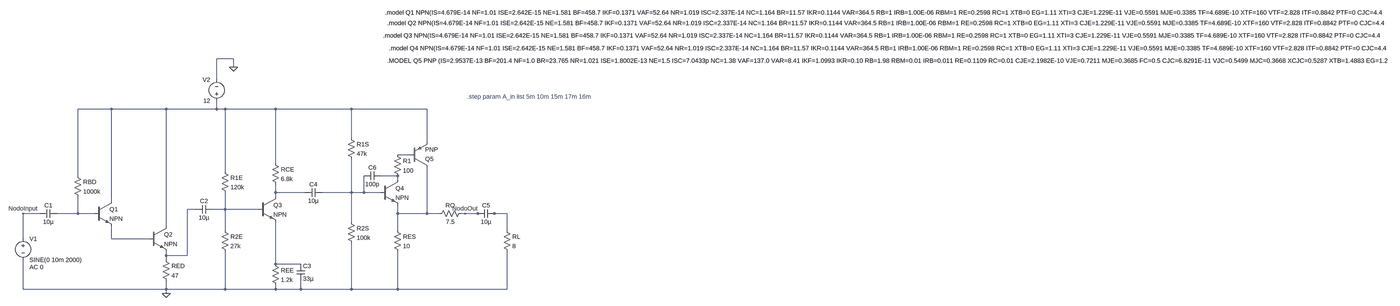
[diagram p0: schematic AmpFinalEstadiscamentecorrecto.asc, whole sheet]
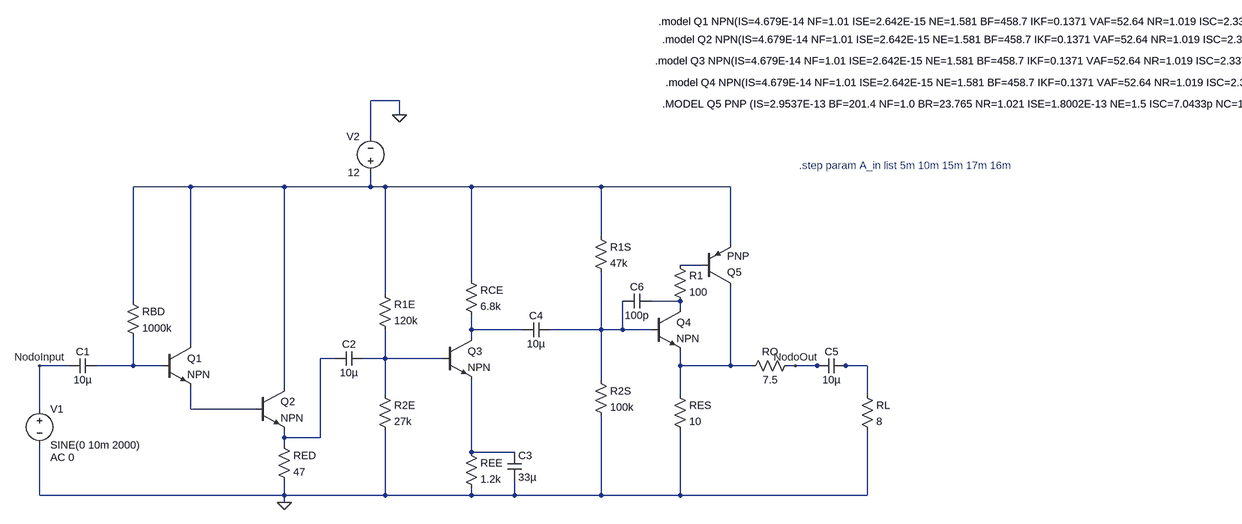
[diagram p1: schematic AmpFinalEstadiscamentecorrecto.asc, part, row 1 of 1, column 1 of 2]
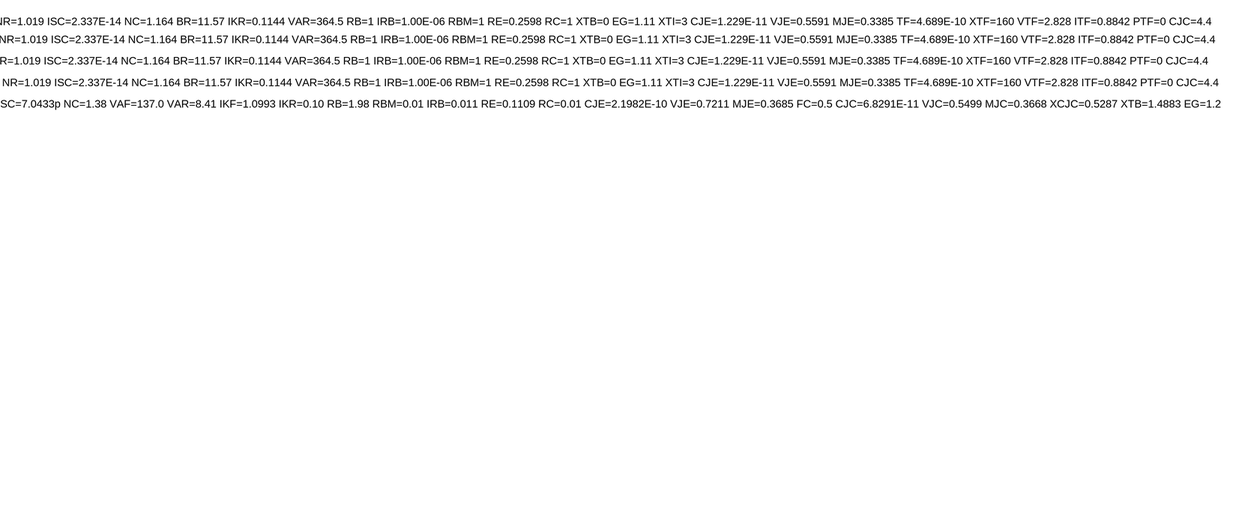
[diagram p2: schematic AmpFinalEstadiscamentecorrecto.asc, part, row 1 of 1, column 2 of 2]
AmpFinalEstadiscamentecorrecto.asc, the LTspice schematic file:
Version 4.1
SHEET 1 6804 680
WIRE 512 -544 448 -544
WIRE 512 -512 512 -544
WIRE 448 -464 448 -544
WIRE 48 -352 -80 -352
WIRE 256 -352 48 -352
WIRE 448 -352 448 -384
WIRE 448 -352 256 -352
WIRE 480 -352 448 -352
WIRE 672 -352 480 -352
WIRE 960 -352 672 -352
WIRE 1248 -352 960 -352
WIRE 960 -224 960 -352
WIRE 1248 -208 1248 -352
WIRE 1184 -160 1136 -160
WIRE 672 -128 672 -352
WIRE 480 -96 480 -352
WIRE -80 -80 -80 -352
WIRE 1136 -80 1072 -80
WIRE 1136 -64 1136 -80
WIRE 672 -16 672 -48
WIRE 784 -16 672 -16
WIRE 960 -16 960 -144
WIRE 960 -16 848 -16
WIRE 1008 -16 1008 -80
WIRE 1008 -16 960 -16
WIRE 1072 -16 1008 -16
WIRE 672 0 672 -16
WIRE 48 16 48 -352
WIRE 368 48 336 48
WIRE 480 48 480 -16
WIRE 480 48 432 48
WIRE 608 48 480 48
WIRE -224 64 -288 64
WIRE -80 64 -80 0
WIRE -80 64 -160 64
WIRE -16 64 -80 64
WIRE 1136 64 1136 32
WIRE 1248 64 1248 -112
WIRE 1248 64 1136 64
WIRE 1296 64 1248 64
WIRE 1392 64 1376 64
WIRE 1440 64 1392 64
WIRE 1456 64 1440 64
WIRE 1504 64 1488 64
WIRE 1552 64 1504 64
WIRE 960 96 960 -16
WIRE 256 112 256 -352
WIRE 480 128 480 48
WIRE 1136 128 1136 64
WIRE 1552 128 1552 64
WIRE -288 160 -288 64
WIRE 48 160 48 112
WIRE 192 160 48 160
WIRE 256 224 256 208
WIRE 336 224 336 48
WIRE 336 224 256 224
WIRE 256 240 256 224
WIRE 672 256 672 96
WIRE 768 256 672 256
WIRE -288 352 -288 240
WIRE 256 352 256 320
WIRE 256 352 -288 352
WIRE 480 352 480 208
WIRE 480 352 256 352
WIRE 672 352 672 336
WIRE 672 352 480 352
WIRE 768 352 768 320
WIRE 768 352 672 352
WIRE 960 352 960 176
WIRE 960 352 768 352
WIRE 1136 352 1136 208
WIRE 1136 352 960 352
WIRE 1552 352 1552 208
WIRE 1552 352 1136 352
WIRE 256 368 256 352
FLAG 256 368 0
FLAG 512 -512 0
FLAG -288 64 NodoInput
FLAG 1392 64 NodoOut
SYMBOL npn -16 16 R0
SYMATTR InstName Q1
SYMBOL res -96 -96 R0
SYMATTR InstName RBD
SYMATTR Value 1000k
SYMBOL cap -160 48 R90
WINDOW 0 0 32 VBottom 2
WINDOW 3 32 32 VTop 2
SYMATTR InstName C1
SYMATTR Value 10µ
SYMBOL npn 192 112 R0
SYMATTR InstName Q2
SYMBOL res 240 224 R0
SYMATTR InstName RED
SYMATTR Value 47
SYMBOL cap 432 32 R90
WINDOW 0 0 32 VBottom 2
WINDOW 3 32 32 VTop 2
SYMATTR InstName C2
SYMATTR Value 10µ
SYMBOL res 464 -112 R0
SYMATTR InstName R1E
SYMATTR Value 120k
SYMBOL res 464 112 R0
SYMATTR InstName R2E
SYMATTR Value 27k
SYMBOL npn 608 0 R0
SYMATTR InstName Q3
SYMBOL res 656 -144 R0
SYMATTR InstName RCE
SYMATTR Value 6.8k
SYMBOL res 656 240 R0
SYMATTR InstName REE
SYMATTR Value 1.2k
SYMBOL cap 752 256 R0
SYMATTR InstName C3
SYMATTR Value 33µ
SYMBOL voltage 448 -368 R180
WINDOW 0 24 96 Left 2
WINDOW 3 24 16 Left 2
SYMATTR InstName V2
SYMATTR Value 12
SYMBOL cap 848 -32 R90
WINDOW 0 0 32 VBottom 2
WINDOW 3 32 32 VTop 2
SYMATTR InstName C4
SYMATTR Value 10µ
SYMBOL res 944 80 R0
SYMATTR InstName R2S
SYMATTR Value 100k
SYMBOL res 944 -240 R0
SYMATTR InstName R1S
SYMATTR Value 47k
SYMBOL npn 1072 -64 R0
SYMATTR InstName Q4
SYMBOL res 1120 112 R0
SYMATTR InstName RES
SYMATTR Value 10
SYMBOL pnp 1184 -112 M180
SYMATTR InstName Q5
SYMBOL voltage -288 144 R0
WINDOW 123 24 124 Left 2
WINDOW 39 0 0 Left 0
SYMATTR Value2 AC 0
SYMATTR InstName V1
SYMATTR Value SINE(0 10m 2000)
SYMBOL res 1536 112 R0
SYMATTR InstName RL
SYMATTR Value 8
SYMBOL res 1392 48 R90
WINDOW 0 0 56 VBottom 2
WINDOW 3 32 56 VTop 2
SYMATTR InstName RO
SYMATTR Value 7.5
SYMBOL cap 1504 48 R90
WINDOW 0 0 32 VBottom 2
WINDOW 3 32 32 VTop 2
SYMATTR InstName C5
SYMATTR Value 10µ
SYMBOL cap 1008 -64 R270
WINDOW 0 32 32 VTop 2
WINDOW 3 0 32 VBottom 2
SYMATTR InstName C6
SYMATTR Value 100p
SYMBOL res 1120 -176 R0
SYMATTR InstName R1
SYMATTR Value 100
TEXT 1088 -720 Left 2 !.model Q1 NPN(IS=4.679E-14 NF=1.01 ISE=2.642E-15 NE=1.581 BF=458.7 IKF=0.1371 VAF=52.64 NR=1.019 ISC=2.337E-14 NC=1.164 BR=11.57 IKR=0.1144 VAR=364.5 RB=1 IRB=1.00E-06 RBM=1 RE=0.2598 RC=1 XTB=0 EG=1.11 XTI=3 CJE=1.229E-11 VJE=0.5591 MJE=0.3385 TF=4.689E-10 XTF=160 VTF=2.828 ITF=0.8842 PTF=0 CJC=4.42E-12 VJC=0.1994 MJC=0.2782 XCJC=0.6193 TR=1.00E-32 CJS=0 VJS=0.75 MJS=0.333 FC=0.7936 Vceo=45 Icrating=100m mfg=Philips)
TEXT 1096 -680 Left 2 !.model Q2 NPN(IS=4.679E-14 NF=1.01 ISE=2.642E-15 NE=1.581 BF=458.7 IKF=0.1371 VAF=52.64 NR=1.019 ISC=2.337E-14 NC=1.164 BR=11.57 IKR=0.1144 VAR=364.5 RB=1 IRB=1.00E-06 RBM=1 RE=0.2598 RC=1 XTB=0 EG=1.11 XTI=3 CJE=1.229E-11 VJE=0.5591 MJE=0.3385 TF=4.689E-10 XTF=160 VTF=2.828 ITF=0.8842 PTF=0 CJC=4.42E-12 VJC=0.1994 MJC=0.2782 XCJC=0.6193 TR=1.00E-32 CJS=0 VJS=0.75 MJS=0.333 FC=0.7936 Vceo=45 Icrating=100m mfg=Philips)
TEXT 1080 -632 Left 2 !.model Q3 NPN(IS=4.679E-14 NF=1.01 ISE=2.642E-15 NE=1.581 BF=458.7 IKF=0.1371 VAF=52.64 NR=1.019 ISC=2.337E-14 NC=1.164 BR=11.57 IKR=0.1144 VAR=364.5 RB=1 IRB=1.00E-06 RBM=1 RE=0.2598 RC=1 XTB=0 EG=1.11 XTI=3 CJE=1.229E-11 VJE=0.5591 MJE=0.3385 TF=4.689E-10 XTF=160 VTF=2.828 ITF=0.8842 PTF=0 CJC=4.42E-12 VJC=0.1994 MJC=0.2782 XCJC=0.6193 TR=1.00E-32 CJS=0 VJS=0.75 MJS=0.333 FC=0.7936 Vceo=45 Icrating=100m mfg=Philips)
TEXT 1104 -584 Left 2 !.model Q4 NPN(IS=4.679E-14 NF=1.01 ISE=2.642E-15 NE=1.581 BF=458.7 IKF=0.1371 VAF=52.64 NR=1.019 ISC=2.337E-14 NC=1.164 BR=11.57 IKR=0.1144 VAR=364.5 RB=1 IRB=1.00E-06 RBM=1 RE=0.2598 RC=1 XTB=0 EG=1.11 XTI=3 CJE=1.229E-11 VJE=0.5591 MJE=0.3385 TF=4.689E-10 XTF=160 VTF=2.828 ITF=0.8842 PTF=0 CJC=4.42E-12 VJC=0.1994 MJC=0.2782 XCJC=0.6193 TR=1.00E-32 CJS=0 VJS=0.75 MJS=0.333 FC=0.7936 Vceo=45 Icrating=100m mfg=Philips)
TEXT 1096 -536 Left 2 !.MODEL Q5 PNP (IS=2.9537E-13 BF=201.4 NF=1.0 BR=23.765 NR=1.021 ISE=1.8002E-13 NE=1.5 ISC=7.0433p NC=1.38 VAF=137.0 VAR=8.41 IKF=1.0993 IKR=0.10 RB=1.98 RBM=0.01 IRB=0.011 RE=0.1109 RC=0.01 CJE=2.1982E-10 VJE=0.7211 MJE=0.3685 FC=0.5 CJC=6.8291E-11 VJC=0.5499 MJC=0.3668 XCJC=0.5287 XTB=1.4883 EG=1.2343 XTI=3.0 Vceo=80 Icrating=3 mfg=fairchild)
TEXT 1400 -400 Left 2 ;.step param A_in list 5m 10m 15m 17m 16m

The netlist it stands for:
* AmpFinalEstadiscamentecorrecto.asc
Q1 N001 N008 N011 0 NPN
RBD N001 N008 1000k
C1 N008 NodoInput 10µ
Q2 N001 N011 N006 0 NPN
RED N006 0 47
C2 N007 N006 10µ
R1E N001 N007 120k
R2E N007 0 27k
Q3 N004 N007 N012 0 NPN
RCE N001 N004 6.8k
REE N012 0 1.2k
C3 N012 0 33µ
V2 N001 0 12
C4 N005 N004 10µ
R2S N005 0 100k
R1S N001 N005 47k
Q4 N003 N005 N009 0 NPN
RES N009 0 10
Q5 N009 N002 N001 0 PNP
V1 NodoInput 0 SINE(0 10m 2000) AC 0
RL N010 0 8
RO NodoOut N009 7.5
C5 N010 NodoOut 10µ
C6 N005 N003 100p
R1 N002 N003 100
.model NPN NPN
.model PNP PNP
.lib standard.bjt
.model Q1 NPN(IS=4.679E-14 NF=1.01 ISE=2.642E-15 NE=1.581 BF=458.7 IKF=0.1371 VAF=52.64 NR=1.019 ISC=2.337E-14 NC=1.164 BR=11.57 IKR=0.1144 VAR=364.5 RB=1 IRB=1.00E-06 RBM=1 RE=0.2598 RC=1 XTB=0 EG=1.11 XTI=3 CJE=1.229E-11 VJE=0.5591 MJE=0.3385 TF=4.689E-10 XTF=160 VTF=2.828 ITF=0.8842 PTF=0 CJC=4.42E-12 VJC=0.1994 MJC=0.2782 XCJC=0.6193 TR=1.00E-32 CJS=0 VJS=0.75 MJS=0.333 FC=0.7936 Vceo=45 Icrating=100m mfg=Philips)
.model Q2 NPN(IS=4.679E-14 NF=1.01 ISE=2.642E-15 NE=1.581 BF=458.7 IKF=0.1371 VAF=52.64 NR=1.019 ISC=2.337E-14 NC=1.164 BR=11.57 IKR=0.1144 VAR=364.5 RB=1 IRB=1.00E-06 RBM=1 RE=0.2598 RC=1 XTB=0 EG=1.11 XTI=3 CJE=1.229E-11 VJE=0.5591 MJE=0.3385 TF=4.689E-10 XTF=160 VTF=2.828 ITF=0.8842 PTF=0 CJC=4.42E-12 VJC=0.1994 MJC=0.2782 XCJC=0.6193 TR=1.00E-32 CJS=0 VJS=0.75 MJS=0.333 FC=0.7936 Vceo=45 Icrating=100m mfg=Philips)
.model Q3 NPN(IS=4.679E-14 NF=1.01 ISE=2.642E-15 NE=1.581 BF=458.7 IKF=0.1371 VAF=52.64 NR=1.019 ISC=2.337E-14 NC=1.164 BR=11.57 IKR=0.1144 VAR=364.5 RB=1 IRB=1.00E-06 RBM=1 RE=0.2598 RC=1 XTB=0 EG=1.11 XTI=3 CJE=1.229E-11 VJE=0.5591 MJE=0.3385 TF=4.689E-10 XTF=160 VTF=2.828 ITF=0.8842 PTF=0 CJC=4.42E-12 VJC=0.1994 MJC=0.2782 XCJC=0.6193 TR=1.00E-32 CJS=0 VJS=0.75 MJS=0.333 FC=0.7936 Vceo=45 Icrating=100m mfg=Philips)
.model Q4 NPN(IS=4.679E-14 NF=1.01 ISE=2.642E-15 NE=1.581 BF=458.7 IKF=0.1371 VAF=52.64 NR=1.019 ISC=2.337E-14 NC=1.164 BR=11.57 IKR=0.1144 VAR=364.5 RB=1 IRB=1.00E-06 RBM=1 RE=0.2598 RC=1 XTB=0 EG=1.11 XTI=3 CJE=1.229E-11 VJE=0.5591 MJE=0.3385 TF=4.689E-10 XTF=160 VTF=2.828 ITF=0.8842 PTF=0 CJC=4.42E-12 VJC=0.1994 MJC=0.2782 XCJC=0.6193 TR=1.00E-32 CJS=0 VJS=0.75 MJS=0.333 FC=0.7936 Vceo=45 Icrating=100m mfg=Philips)
.MODEL Q5 PNP (IS=2.9537E-13 BF=201.4 NF=1.0 BR=23.765 NR=1.021 ISE=1.8002E-13 NE=1.5 ISC=7.0433p NC=1.38 VAF=137.0 VAR=8.41 IKF=1.0993 IKR=0.10 RB=1.98 RBM=0.01 IRB=0.011 RE=0.1109 RC=0.01 CJE=2.1982E-10 VJE=0.7211 MJE=0.3685 FC=0.5 CJC=6.8291E-11 VJC=0.5499 MJC=0.3668 XCJC=0.5287 XTB=1.4883 EG=1.2343 XTI=3.0 Vceo=80 Icrating=3 mfg=fairchild)
* .step param A_in list 5m 10m 15m 17m 16m
.backanno
.end